# EAGLE design USB3300 (EAGLE 7.6.0)
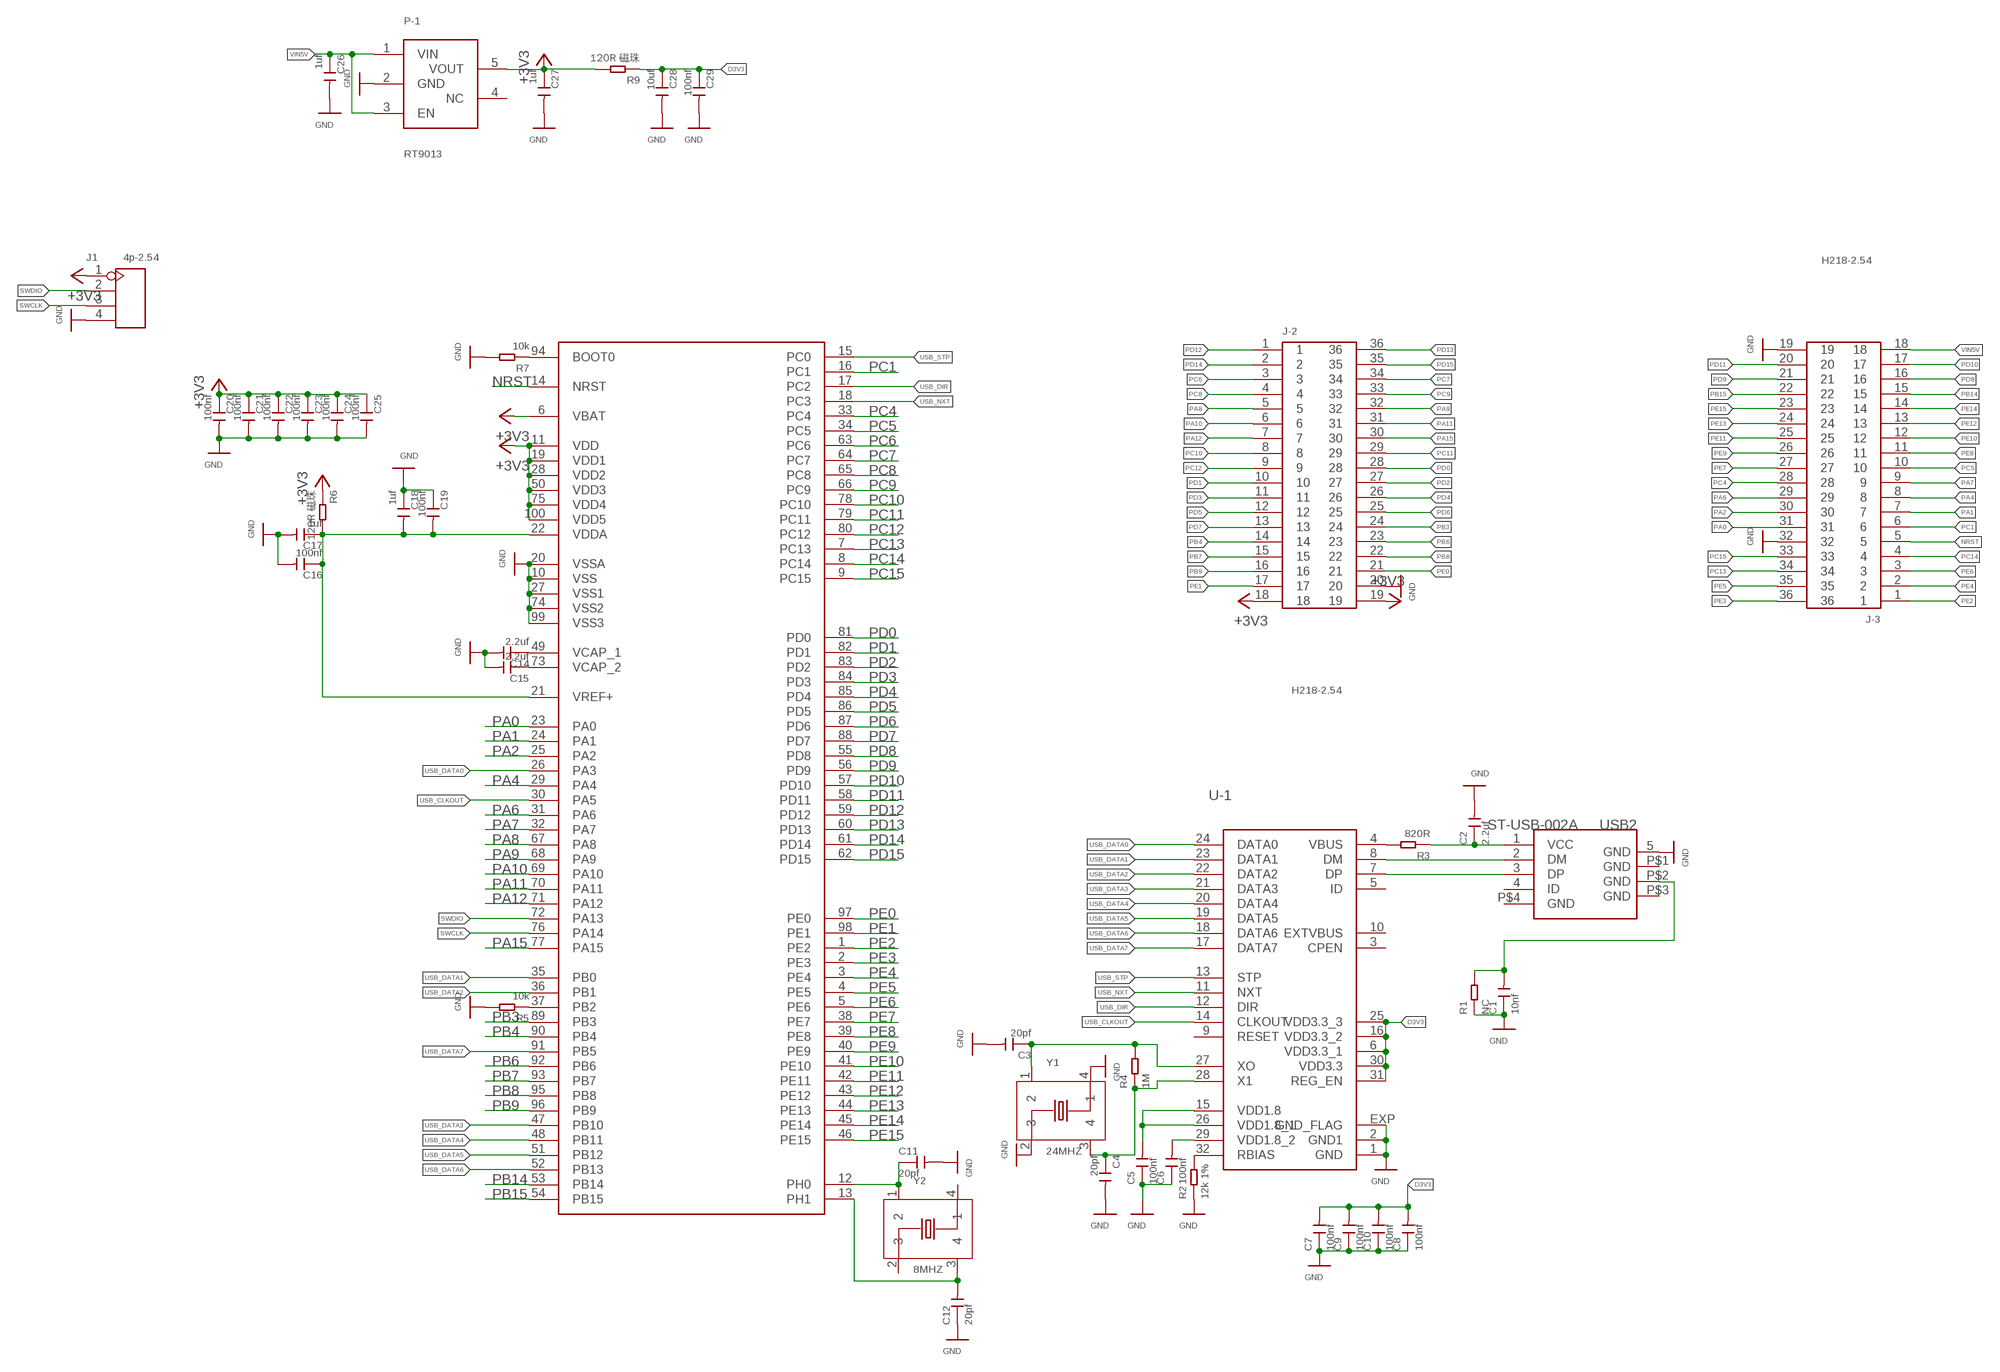
[diagram p0: schematic, sheet 1]

## Parts
C1  10nf  CERAMIC-0.5PF-50V-0.1PF-NPO(0603)  [C0603]
C2  2.2uf  CERAMIC-0.5PF-50V-0.1PF-NPO(0603)  [C0603]
C3  20pf  CERAMIC-0.5PF-50V-0.1PF-NPO(0603)  [C0603]
C4  20pf  CERAMIC-0.5PF-50V-0.1PF-NPO(0603)  [C0603]
C5  100nf  CERAMIC-0.5PF-50V-0.1PF-NPO(0603)  [C0603]
C6  100nf  CERAMIC-0.5PF-50V-0.1PF-NPO(0603)  [C0603]
C7  100nf  CERAMIC-0.5PF-50V-0.1PF-NPO(0603)  [C0603]
C8  100nf  CERAMIC-0.5PF-50V-0.1PF-NPO(0603)  [C0603]
C9  100nf  CERAMIC-0.5PF-50V-0.1PF-NPO(0603)  [C0603]
C10  100nf  CERAMIC-0.5PF-50V-0.1PF-NPO(0603)  [C0603]
C11  20pf  CERAMIC-0.5PF-50V-0.1PF-NPO(0603)  [C0603]
C12  20pf  CERAMIC-0.5PF-50V-0.1PF-NPO(0603)  [C0603]
C14  2.2uf  CERAMIC-0.5PF-50V-0.1PF-NPO(0603)  [C0603]
C15  2.2uf  CERAMIC-0.5PF-50V-0.1PF-NPO(0603)  [C0603]
C16  100nf  CERAMIC-0.5PF-50V-0.1PF-NPO(0603)  [C0603]
C17  1uf  CERAMIC-0.5PF-50V-0.1PF-NPO(0603)  [C0603]
C18  1uf  CERAMIC-0.5PF-50V-0.1PF-NPO(0603)  [C0603]
C19  100nf  CERAMIC-0.5PF-50V-0.1PF-NPO(0603)  [C0603]
C20  100nf  CERAMIC-0.5PF-50V-0.1PF-NPO(0603)  [C0603]
C21  100nf  CERAMIC-0.5PF-50V-0.1PF-NPO(0603)  [C0603]
C22  100nf  CERAMIC-0.5PF-50V-0.1PF-NPO(0603)  [C0603]
C23  100nf  CERAMIC-0.5PF-50V-0.1PF-NPO(0603)  [C0603]
C24  100nf  CERAMIC-0.5PF-50V-0.1PF-NPO(0603)  [C0603]
C25  100nf  CERAMIC-0.5PF-50V-0.1PF-NPO(0603)  [C0603]
C26  1uf  CERAMIC-0.5PF-50V-0.1PF-NPO(0603)  [C0603]
C27  1uf  CERAMIC-0.5PF-50V-0.1PF-NPO(0603)  [C0603]
C28  10uf  CERAMIC-0.5PF-50V-0.1PF-NPO(0603)  [C0603]
C29  100nf  CERAMIC-0.5PF-50V-0.1PF-NPO(0603)  [C0603]
J1  4p-2.54  DIP-BLACK-FEMALE-HEADER-VERT(4P-2.54)  [H4-2.54]
J-2  H218-2.54  [H2X18-2.54]
J-3  H218-2.54  [H2X18-2.54]
P-1  RT9013  [SOT23-5]
R1  NC  SMD-RES-0R-1%-1/10W(0603)  [R0603]
R2  12k 1%  SMD-RES-0R-1%-1/10W(0603)  [R0603]
R3  820R  SMD-RES-0R-1%-1/10W(0603)  [R0603]
R4  1M  SMD-RES-0R-1%-1/10W(0603)  [R0603]
R5  10k  SMD-RES-0R-1%-1/10W(0603)  [R0603]
R6  120R 磁珠  SMD-RES-0R-1%-1/10W(0603)  [R0603]
R7  10k  SMD-RES-0R-1%-1/10W(0603)  [R0603]
R9  120R 磁珠  SMD-RES-0R-1%-1/10W(0603)  [R0603]
U$1  STM32F40XSTM32D40X  [LQFP100]
U-1  USB3300  [QFN32]
USB2  ST-USB-002A  MINI-USB-RCPT-B-5PS-R/A-SMD(ST-USB-002A)  [MINIUSB5+4P-SMD-0.8-90D]
Y1  24MHZ  SMD-CRYSTAL-30MHZ-10PF-10PPM-60R(4P-3.2X2.5MM)  [X4-SMD-3.2X2.5X0.7MM]
Y2  8MHZ  SMD-CRYSTAL-27.12MHZ-18PF-30PPM-60R(4P-3.2X2.5MM)  [X4-SMD-3.2X2.5X0.7MM]

## Nets
+3V3: C20.1 C21.1 C22.1 C23.1 C24.1 C25.1 C27.1 J1.1 J-2.18 J-2.19 P-1.5(VOUT) R6.1 R9.2 U$1.6(VBAT) U$1.11(VDD) U$1.19(VDD1) U$1.28(VDD2) U$1.50(VDD3) U$1.75(VDD4) U$1.100(VDD5)
D3V3: C7.2 C8.2 C9.2 C10.2 C28.1 C29.1 R9.1 U-1.6(VDD3.3_1) U-1.16(VDD3.3_2) U-1.25(VDD3.3_3) U-1.30(VDD3.3) U-1.31(REG_EN)
GND: C1.1 C2.2 C3.2 C4.2 C5.1 C6.1 C7.1 C8.1 C9.1 C10.1 C11.2 C12.1 C14.2 C15.2 C16.2 C17.2 C18.1 C19.1 C20.2 C21.2 C22.2 C23.2 C24.2 C25.2 C26.2 C27.2 C28.2 C29.2 J1.4 J-2.20 J-3.19 J-3.32 P-1.2(GND) R1.1 R2.1 R5.2 R7.2 U$1.10(VSS) U$1.20(VSSA) U$1.27(VSS1) U$1.74(VSS2) U$1.99(VSS3) U-1.1(GND) U-1.2(GND1) U-1.EXP(GND_FLAG) USB2.5(GND) Y1.2 Y1.4
N$1: U-1.8(DM) USB2.2(DM)
N$2: U-1.7(DP) USB2.3(DP)
N$3: C3.1 R4.2 U-1.27(XO) Y1.1
N$4: R2.2 U-1.32(RBIAS)
N$5: R3.2 U-1.4(VBUS)
N$6: C4.1 R4.1 U-1.28(X1) Y1.3
N$7: C5.2 U-1.15(VDD1.8) U-1.26(VDD1.8_1)
N$8: C6.2 U-1.29(VDD1.8_2)
N$9: C11.1 U$1.12(PH0) Y2.1
N$10: C12.2 U$1.13(PH1) Y2.3
N$11: R7.1 U$1.94(BOOT0)
N$12: C16.1 C17.1 C18.2 C19.2 R6.2 U$1.21(VREF+) U$1.22(VDDA)
N$13: C14.1 U$1.49(VCAP_1)
N$14: C15.1 U$1.73(VCAP_2)
N$15: C2.1 R3.1 USB2.1(VCC)
N$16: R5.1 U$1.37(PB2)
N$18: C1.2 R1.2 USB2.P$2(GND)
NRST: J-3.5 U$1.14(NRST)
PA0: J-3.31 U$1.23(PA0)
PA1: J-3.7 U$1.24(PA1)
PA2: J-3.30 U$1.25(PA2)
PA4: J-3.8 U$1.29(PA4)
PA6: J-3.29 U$1.31(PA6)
PA7: J-3.9 U$1.32(PA7)
PA8: J-2.5 U$1.67(PA8)
PA9: J-2.32 U$1.68(PA9)
PA10: J-2.6 U$1.69(PA10)
PA11: J-2.31 U$1.70(PA11)
PA12: J-2.7 U$1.71(PA12)
PA15: J-2.30 U$1.77(PA15)
PB3: J-2.24 U$1.89(PB3)
PB4: J-2.14 U$1.90(PB4)
PB6: J-2.23 U$1.92(PB6)
PB7: J-2.15 U$1.93(PB7)
PB8: J-2.22 U$1.95(PB8)
PB9: J-2.16 U$1.96(PB9)
PB14: J-3.15 U$1.53(PB14)
PB15: J-3.22 U$1.54(PB15)
PC1: J-3.6 U$1.16(PC1)
PC4: J-3.28 U$1.33(PC4)
PC5: J-3.10 U$1.34(PC5)
PC6: J-2.3 U$1.63(PC6)
PC7: J-2.34 U$1.64(PC7)
PC8: J-2.4 U$1.65(PC8)
PC9: J-2.33 U$1.66(PC9)
PC10: J-2.8 U$1.78(PC10)
PC11: J-2.29 U$1.79(PC11)
PC12: J-2.9 U$1.80(PC12)
PC13: J-3.34 U$1.7(PC13)
PC14: J-3.4 U$1.8(PC14)
PC15: J-3.33 U$1.9(PC15)
PD0: J-2.28 U$1.81(PD0)
PD1: J-2.10 U$1.82(PD1)
PD2: J-2.27 U$1.83(PD2)
PD3: J-2.11 U$1.84(PD3)
PD4: J-2.26 U$1.85(PD4)
PD5: J-2.12 U$1.86(PD5)
PD6: J-2.25 U$1.87(PD6)
PD7: J-2.13 U$1.88(PD7)
PD8: J-3.16 U$1.55(PD8)
PD9: J-3.21 U$1.56(PD9)
PD10: J-3.17 U$1.57(PD10)
PD11: J-3.20 U$1.58(PD11)
PD12: J-2.1 U$1.59(PD12)
PD13: J-2.36 U$1.60(PD13)
PD14: J-2.2 U$1.61(PD14)
PD15: J-2.35 U$1.62(PD15)
PE0: J-2.21 U$1.97(PE0)
PE1: J-2.17 U$1.98(PE1)
PE2: J-3.1 U$1.1(PE2)
PE3: J-3.36 U$1.2(PE3)
PE4: J-3.2 U$1.3(PE4)
PE5: J-3.35 U$1.4(PE5)
PE6: J-3.3 U$1.5(PE6)
PE7: J-3.27 U$1.38(PE7)
PE8: J-3.11 U$1.39(PE8)
PE9: J-3.26 U$1.40(PE9)
PE10: J-3.12 U$1.41(PE10)
PE11: J-3.25 U$1.42(PE11)
PE12: J-3.13 U$1.43(PE12)
PE13: J-3.24 U$1.44(PE13)
PE14: J-3.14 U$1.45(PE14)
PE15: J-3.23 U$1.46(PE15)
SWCLK: J1.3 U$1.76(PA14)
SWDIO: J1.2 U$1.72(PA13)
USB_CLKOUT: U$1.30(PA5) U-1.14(CLKOUT)
USB_DATA0: U$1.26(PA3) U-1.24(DATA0)
USB_DATA1: U$1.35(PB0) U-1.23(DATA1)
USB_DATA2: U$1.36(PB1) U-1.22(DATA2)
USB_DATA3: U$1.47(PB10) U-1.21(DATA3)
USB_DATA4: U$1.48(PB11) U-1.20(DATA4)
USB_DATA5: U$1.51(PB12) U-1.19(DATA5)
USB_DATA6: U$1.52(PB13) U-1.18(DATA6)
USB_DATA7: U$1.91(PB5) U-1.17(DATA7)
USB_DIR: U$1.17(PC2) U-1.12(DIR)
USB_NXT: U$1.18(PC3) U-1.11(NXT)
USB_STP: U$1.15(PC0) U-1.13(STP)
VIN5V: C26.1 J-3.18 P-1.1(VIN) P-1.3(EN)
Unconnected: P-1.4(NC) U-1.3(CPEN) U-1.5(ID) U-1.9(RESET) U-1.10(EXTVBUS) USB2.4(ID) USB2.P$1(GND) USB2.P$3(GND) USB2.P$4(GND) Y2.2 Y2.4

## Library data of the parts
C1-C12 C14-C29 = Seeed-OPL-Capacitor:CERAMIC-0.5PF-50V-0.1PF-NPO(0603): 302010115; VALUE: 0.5PF 50V
J1 = Seeed-OPL-Connector:DIP-BLACK-FEMALE-HEADER-VERT(4P-2.54): 320030017; MPN: F185-1104A1BSYA1
J-2 J-3 = 64ch EEG:H2*18-2.54
P-1 = 1-LDA_Board:RT9013
R1-R7 R9 = Seeed-OPL-Resistor:SMD-RES-0R-1%-1/10W(0603): 301010203; MPN: AC0603FR-070RL; VALUE: 0R 1/10W
U$1 = 1-intan:STM32F40X: Features • Core: ARM 32-bit Cortex™-M4 CPU with FPU, Adaptive real-time accelerator (ART Accelerator™) allowing 0-wait state execution from Flash memory, frequency up to 168 MHz, memory protection unit, 210 DMIPS/ 1.25 DMIPS/MHz (Dhrystone 2.1), and DSP instructions • Memories – Up to 1 Mbyte of Flash memory – Up to 192+4 Kbytes of SRAM including 64- Kbyte of CCM (core coupled memory) data RAM – Flexible static memory controller supporting Compact Flash, SRAM, PSRAM, NOR and NAND memories • LCD parallel interface, 8080/6800 modes • Clock, reset and supply management – 1.8 V to 3.6 V application supply and I/Os – POR, PDR, PVD and BOR – 4-to-26 MHz crystal oscillator – Internal 16 MHz factory-trimmed RC (1% accuracy) – 32 kHz oscillator for RTC with calibration – Internal 32 kHz RC with calibration • Low power – Sleep, Stop and Standby modes – VBAT supply for RTC, 20×32 bit backup registers + optional 4 KB backup SRAM • 3×12-bit, 2.4 MSPS A/D converters: up to 24 channels and 7.2 MSPS in triple interleaved mode • 2×12-bit D/A converters • General-purpose DMA: 16-stream DMA controller with FIFOs and burst support • Up to 17 timers: up to twelve 16-bit and two 32- bit timers up to 168 MHz, each with up to 4 IC/OC/PWM or pulse counter and quadrature (incremental) encoder input • Debug mode – Serial wire debug (SWD) & JTAG interfaces – Cortex-M4 Embedded Trace Macrocell™ • Up to 140 I/O ports with interrupt capability – Up to 136 fast I/Os up to 84 MHz – Up to 138 5 V-tolerant I/Os • Up to 15 communication interfaces – Up to 3 × I2C interfaces (SMBus/PMBus) – Up to 4 USARTs/2 UARTs (10.5 Mbit/s, ISO 7816 interface, LIN, IrDA, modem control) – Up to 3 SPIs (42 Mbits/s), 2 with muxed full-duplex I2S to achieve audio class accuracy via internal audio PLL or external clock – 2 × CAN interfaces (2.0B Active) – SDIO interface • Advanced connectivity – USB 2.0 full-speed device/host/OTG controller with on-chip PHY – USB 2.0 high-speed/full-speed device/host/OTG controller with dedicated DMA, on-chip full-speed PHY and ULPI – 10/100 Ethernet MAC with dedicated DMA: supports IEEE 1588v2 hardware, MII/RMII • 8- to 14-bit parallel camera interface up to 54 Mbytes/s • True random number generator • CRC calculation unit • 96-bit unique ID • RTC: subsecond accuracy, hardware calendar
U-1 = 64ch EEG:USB3300
USB2 = Seeed-OPL-Connector:MINI-USB-RCPT-B-5PS-R/A-SMD(ST-USB-002A): 320010013; MPN: ST-USB-002A
Y1 = Seeed-OPL-Crystal-Oscillator:SMD-CRYSTAL-30MHZ-10PF-10PPM-60R(4P-3.2X2.5MM): 306010035; MPN: 7M30000024; VALUE: 30MHZ
Y2 = 1-LDA_Board:SMD-CRYSTAL-27.12MHZ-18PF-30PPM-60R(4P-3.2X2.5MM): 306010027; MPN: 7M-27.120MAAJ-T; VALUE: 27.12MHZ

## Board
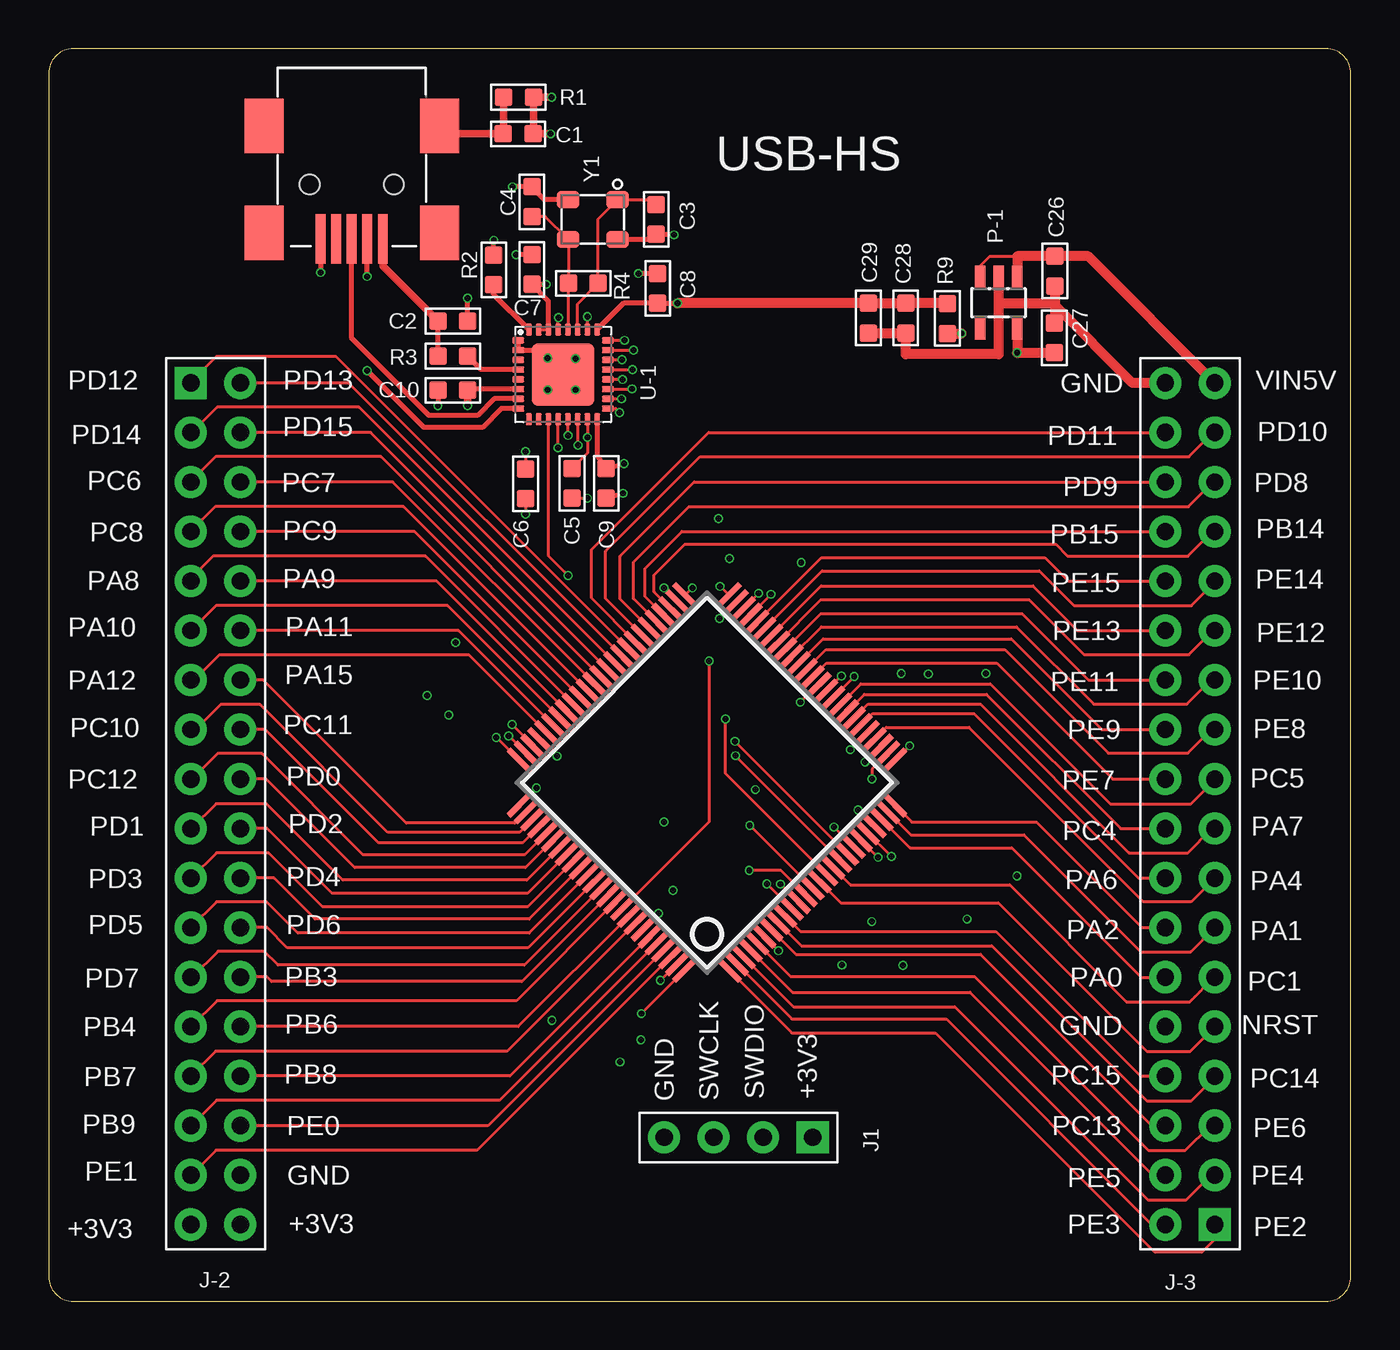
[diagram p1: board, top side]
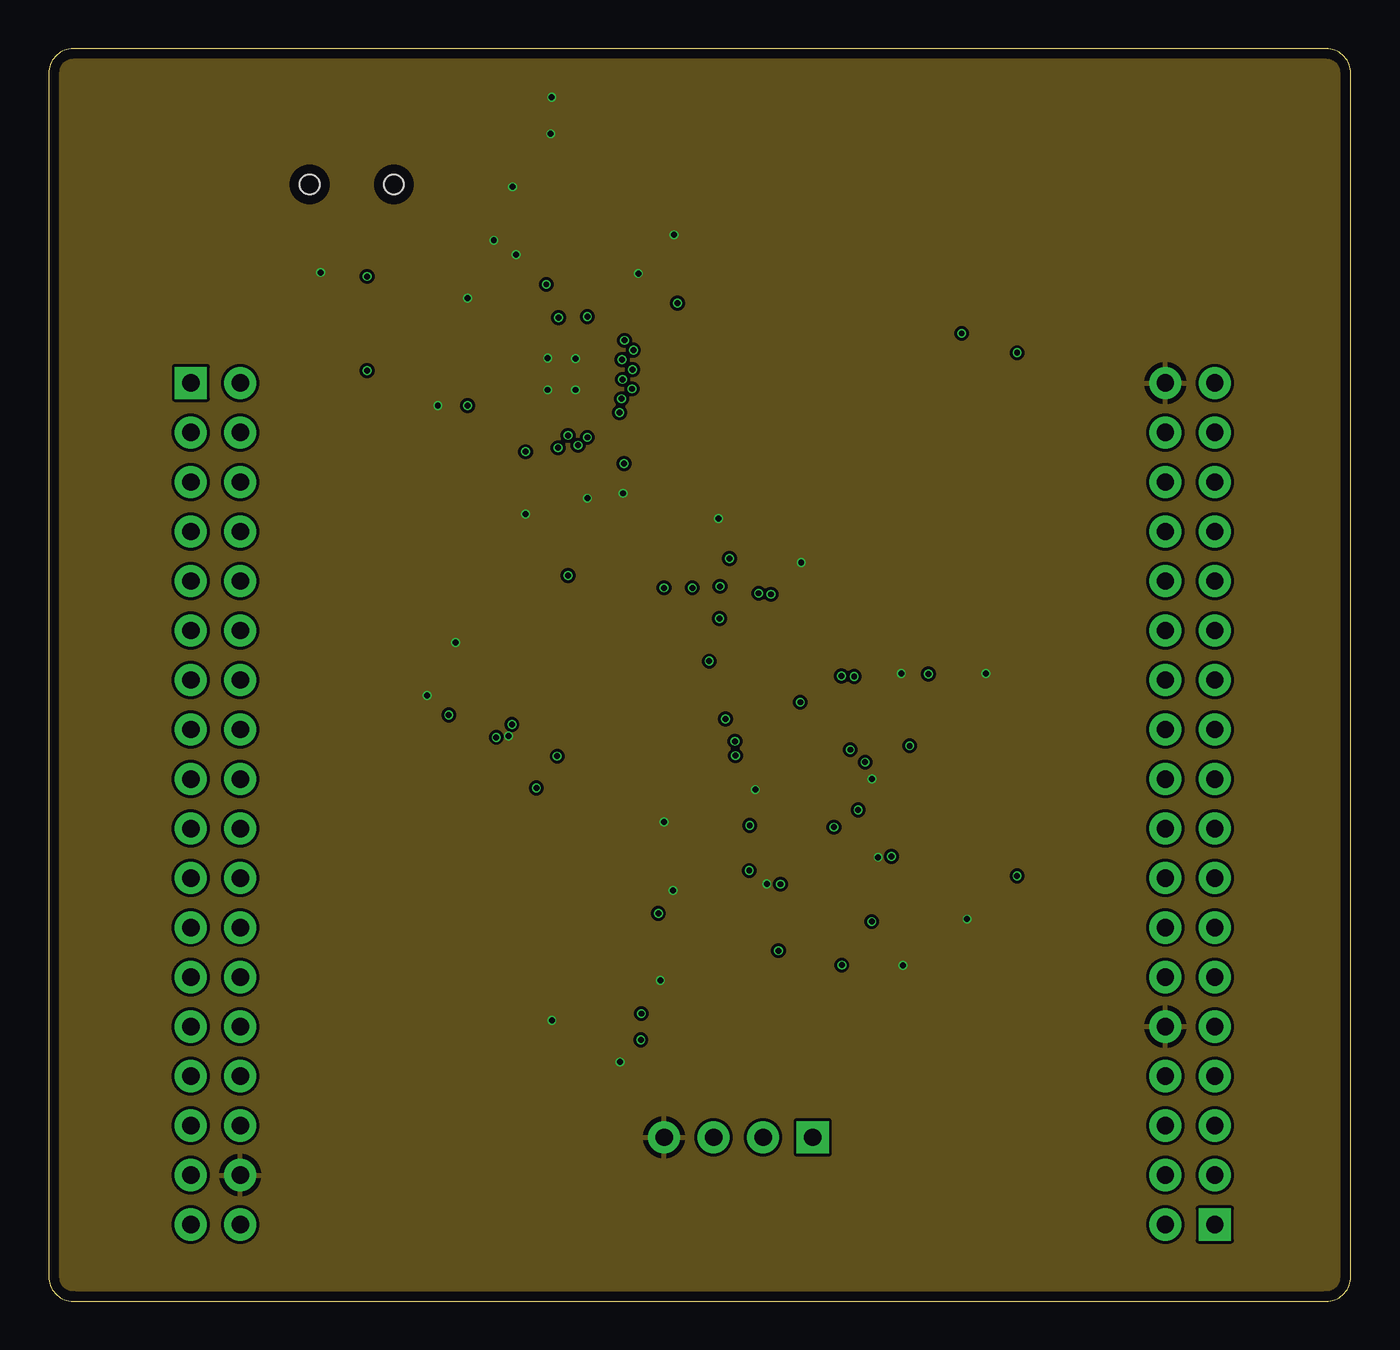
[diagram p2: board, inner layer Gnd]
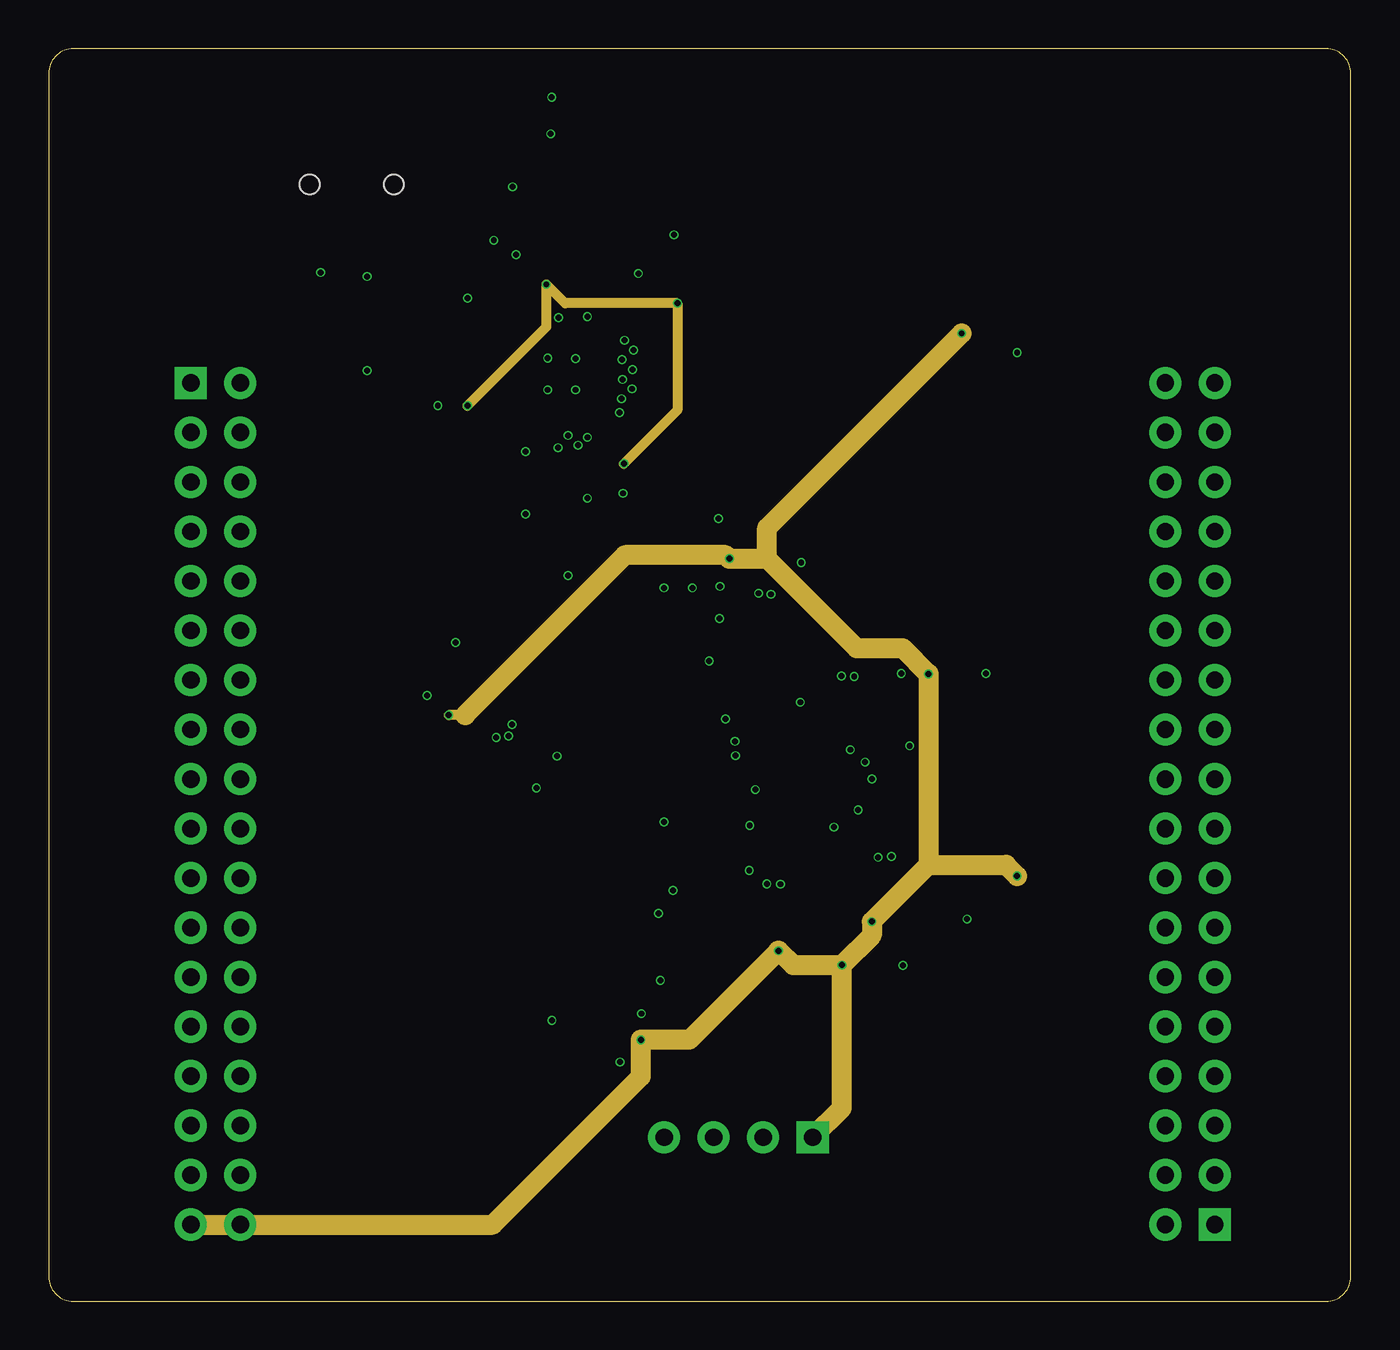
[diagram p3: board, inner layer Vcc]
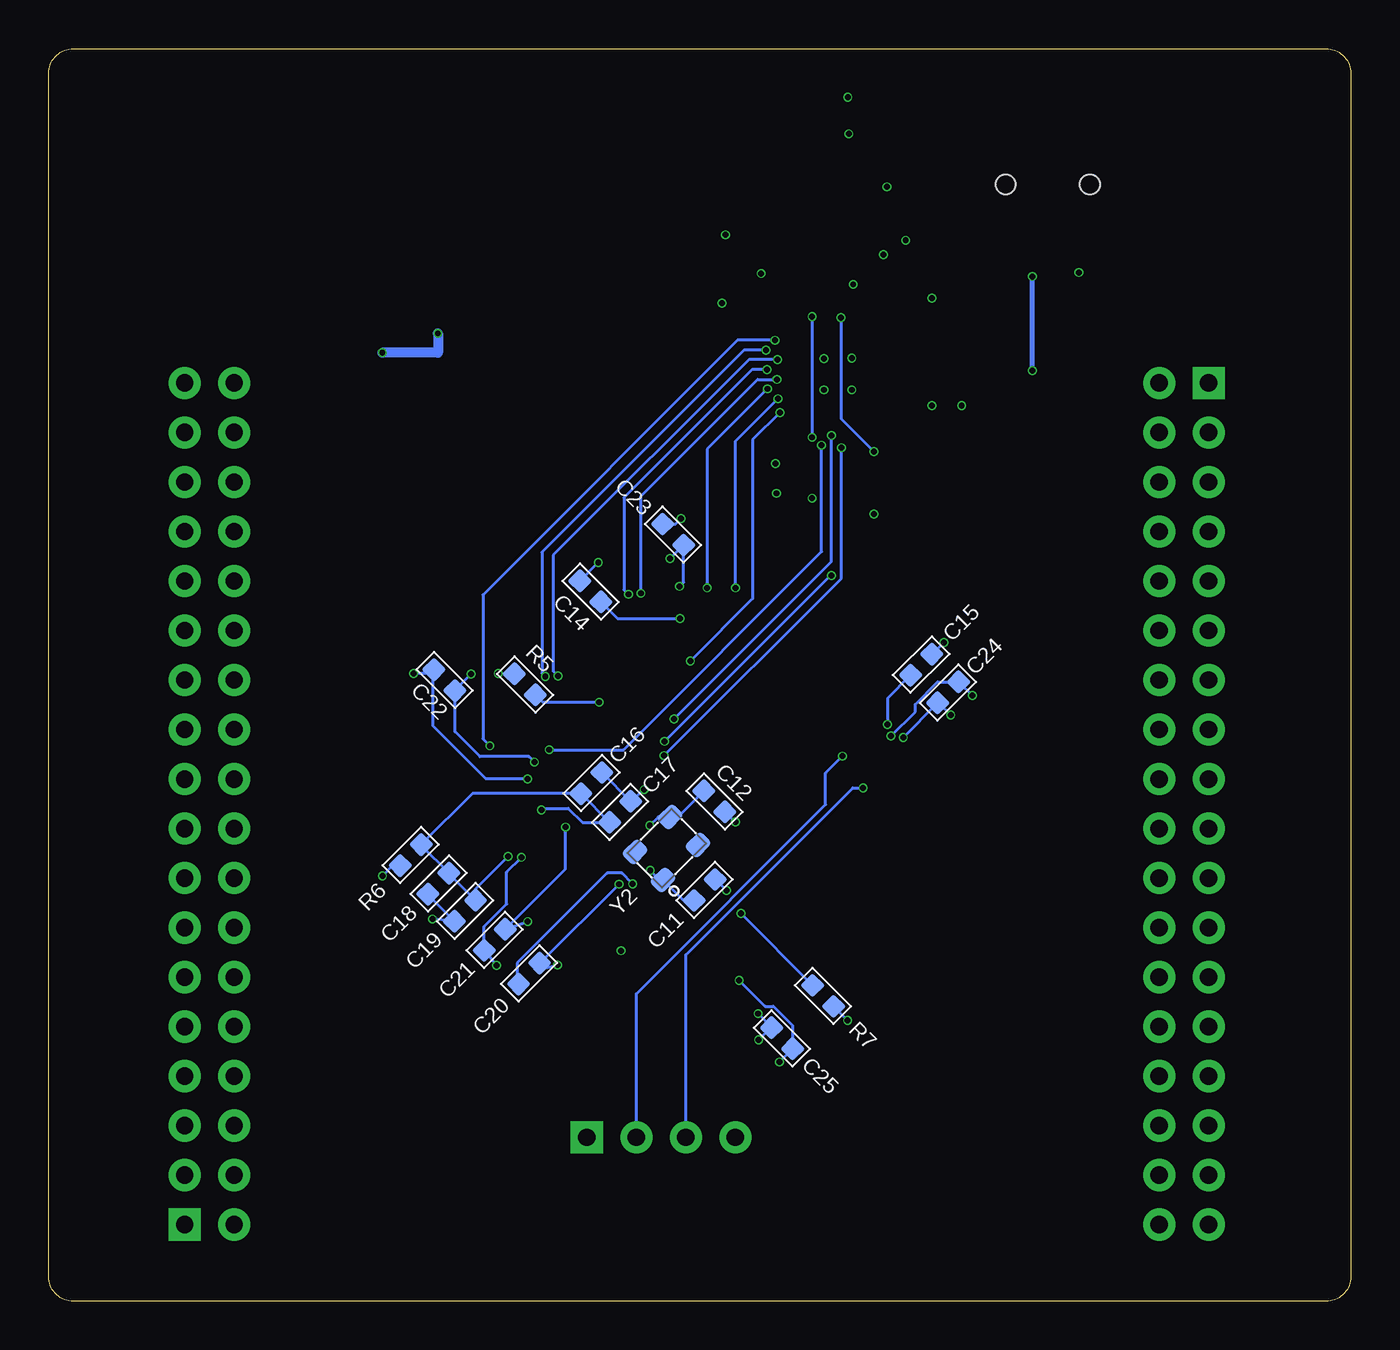
[diagram p4: board, bottom side, seen from below]

Size 66.8 x 64.26 mm. Coordinates in mm from the lower left corner, seen from the top.
Outline: 0,62.99 0,1.27 arc90 1.27,0 65.53,0 arc90 66.8,1.27 66.8,62.99 arc90 65.53,64.26 1.27,64.26 arc90 0,62.99
Copper layers (1*2+3*16): Top 0.035mm / dielectric 1.5mm / Gnd 0.035mm / dielectric 0.15mm / Vcc 0.035mm / dielectric 0.2mm / Bottom 0.035mm
Design rules "default *": minimum track width 6mil, minimum drill 12mil, track to track 6mil, track to pad 6mil, pad to pad 6mil, via to via 6mil, smd to smd 6mil, copper to edge 20mil, drill to drill 8mil, minimum pad ring 2mil, minimum via ring 2mil, stop-mask expansion 2mil, vias tented up to drill 12mil, thermal gap 10mil

### Footprints (pad centres in the part's own frame; a part is rotated, then mirrored left to right if it is on the bottom)
C0603 = smd 0.889 x 0.889: 1 0,0.762; 2 0,-0.762
H4-2.54 = drill 0.889 pad 1.651 square: 1 0,3.81 | drill 0.889 pad 1.651: 2 0,1.27; 3 0,-1.27; 4 0,-3.81
H2X18-2.54 = drill 0.889 pad 1.651 square: 1 -1.27,21.59 | drill 0.889 pad 1.651: 2 -1.27,19.05; 3 -1.27,16.51; 4 -1.27,13.97; 5 -1.27,11.43; 6 -1.27,8.89; 7 -1.27,6.35; 8 -1.27,3.81; 9 -1.27,1.27; 10 -1.27,-1.27; 11 -1.27,-3.81; 12 -1.27,-6.35; 13 -1.27,-8.89; 14 -1.27,-11.43; 15 -1.27,-13.97; 16 -1.27,-16.51; 17 -1.27,-19.05; 18 -1.27,-21.59; 19 1.27,-21.59; 20 1.27,-19.05; 21 1.27,-16.51; 22 1.27,-13.97; 23 1.27,-11.43; 24 1.27,-8.89; 25 1.27,-6.35; 26 1.27,-3.81; 27 1.27,-1.27; 28 1.27,1.27; 29 1.27,3.81; 30 1.27,6.35; 31 1.27,8.89; 32 1.27,11.43; 33 1.27,13.97; 34 1.27,16.51; 35 1.27,19.05; 36 1.27,21.59
SOT23-5 = smd 0.55 x 1.2: 1 -0.95,-1.3; 2 0,-1.3; 3 0.95,-1.3; 4 0.95,1.3; 5 -0.95,1.3
R0603 = smd 0.889 x 0.889: 1 0,0.762; 2 0,-0.762
LQFP100 = smd 1.6 x 0.3: 1 -7.6,6; 2 -7.6,5.5; 3 -7.6,5; 4 -7.6,4.5; 5 -7.6,4; 6 -7.6,3.5; 7 -7.6,3; 8 -7.6,2.5; 9 -7.6,2; 10 -7.6,1.5; 11 -7.6,1; 12 -7.6,0.5; 13 -7.6,0; 14 -7.6,-0.5; 15 -7.6,-1; 16 -7.6,-1.5; 17 -7.6,-2; 18 -7.6,-2.5; 19 -7.6,-3; 20 -7.6,-3.5; 21 -7.6,-4; 22 -7.6,-4.5; 23 -7.6,-5; 24 -7.6,-5.5; 25 -7.6,-6; 51 7.6,-6; 52 7.6,-5.5; 53 7.6,-5; 54 7.6,-4.5; 55 7.6,-4; 56 7.6,-3.5; 57 7.6,-3; 58 7.6,-2.5; 59 7.6,-2; 60 7.6,-1.5; 61 7.6,-1; 62 7.6,-0.5; 63 7.6,0; 64 7.6,0.5; 65 7.6,1; 66 7.6,1.5; 67 7.6,2; 68 7.6,2.5; 69 7.6,3; 70 7.6,3.5; 71 7.6,4; 72 7.6,4.5; 73 7.6,5; 74 7.6,5.5; 75 7.6,6 | smd 0.3 x 1.6: 26 -6,-7.6; 27 -5.5,-7.6; 28 -5,-7.6; 29 -4.5,-7.6; 30 -4,-7.6; 31 -3.5,-7.6; 32 -3,-7.6; 33 -2.5,-7.6; 34 -2,-7.6; 35 -1.5,-7.6; 36 -1,-7.6; 37 -0.5,-7.6; 38 0,-7.6; 39 0.5,-7.6; 40 1,-7.6; 41 1.5,-7.6; 42 2,-7.6; 43 2.5,-7.6; 44 3,-7.6; 45 3.5,-7.6; 46 4,-7.6; 47 4.5,-7.6; 48 5,-7.6; 49 5.5,-7.6; 50 6,-7.6; 76 6,7.6; 77 5.5,7.6; 78 5,7.6; 79 4.5,7.6; 80 4,7.6; 81 3.5,7.6; 82 3,7.6; 83 2.5,7.6; 84 2,7.6; 85 1.5,7.6; 86 1,7.6; 87 0.5,7.6; 88 0,7.6; 89 -0.5,7.6; 90 -1,7.6; 91 -1.5,7.6; 92 -2,7.6; 93 -2.5,7.6; 94 -3,7.6; 95 -3.5,7.6; 96 -4,7.6; 97 -4.5,7.6; 98 -5,7.6; 99 -5.5,7.6; 100 -6,7.6
QFN32 = smd 0.6 x 0.3: 1 -2.3,1.75; 2 -2.3,1.25; 3 -2.3,0.75; 4 -2.3,0.25; 5 -2.3,-0.25; 6 -2.3,-0.75; 7 -2.3,-1.25; 8 -2.3,-1.75; 17 2.3,-1.75; 18 2.3,-1.25; 19 2.3,-0.75; 20 2.3,-0.25; 21 2.3,0.25; 22 2.3,0.75; 23 2.3,1.25; 24 2.3,1.75 | smd 0.3 x 0.6: 9 -1.75,-2.3; 10 -1.25,-2.3; 11 -0.75,-2.3; 12 -0.25,-2.3; 13 0.25,-2.3; 14 0.75,-2.3; 15 1.25,-2.3; 16 1.75,-2.3; 25 1.75,2.3; 26 1.25,2.3; 27 0.75,2.3; 28 0.25,2.3; 29 -0.25,2.3; 30 -0.75,2.3; 31 -1.25,2.3; 32 -1.75,2.3 | smd 3.2 x 3.2: EXP 0,0
MINIUSB5+4P-SMD-0.8-90D = smd 2.54 x 0.508: 1 0.381,-1.6; 2 0.381,-0.8; 3 0.381,0; 4 0.381,0.8; 5 0.381,1.6 | smd 2.794 x 2: P$1 6.175,4.5; P$2 6.175,-4.5; P$3 0.675,4.5; P$4 0.675,-4.5 | hole 1.016: 3.175,-2.159; 3.175,2.159
X4-SMD-3.2X2.5X0.7MM = smd 1.143 x 0.889: 1 -1.27,-1.016; 2 1.27,-1.016; 3 1.27,1.016; 4 -1.27,1.016

### Placement (x,y rotation side)
C1  24.08,59.89 270 top
C2  20.73,50.29 90 top
C3  31.17,55.5 0 top
C4  24.79,56.41 180 top
C5  26.85,41.96 180 top
C6  24.46,41.94 180 top
C7  24.79,52.93 0 top
C8  31.24,51.97 0 top
C9  28.6,41.96 180 top
C10  20.73,46.74 90 top
C11  33.15,21.1 135 bottom
C12  32.65,25.65 225 bottom
C14  39.01,36.42 225 bottom
C15  22.04,32.66 135 bottom
C16  38.96,26.59 135 bottom
C17  37.49,25.12 135 bottom
C18  46.81,21.43 135 bottom
C19  45.44,20.03 135 bottom
C20  42.16,16.82 315 bottom
C21  43.92,18.54 315 bottom
C22  46.5,31.87 225 bottom
C23  34.77,39.34 225 bottom
C24  20.66,31.24 135 bottom
C25  29.17,13.5 45 bottom
C26  51.62,52.85 0 top
C27  51.6,49.43 180 top
C28  43.97,50.44 0 top
C29  42.06,50.44 0 top
J1  35.38,8.41 270 top
J-2  8.56,25.52 0 top
J-3  58.56,25.52 180 top
P-1  48.73,51.23 180 top
R1  24.1,61.77 270 top
R2  22.83,52.91 0 top
R3  20.73,48.49 90 top
R4  27.43,52.22 90 top
R5  42.38,31.65 225 bottom
R6  48.23,22.89 135 bottom
R7  27.07,15.67 45 bottom
R9  46.1,50.42 0 top
U$1  33.77,26.61 135 top
U-1  26.39,47.55 0 top
USB2  15.54,54.13 90 top
Y1  27.91,55.5 180 top
Y2  35.1,23.24 45 bottom

### Tracks (layer width: path | path; a pad name or v marks a point on that pad's centre or on a via)
+3V3  (via drill 0.3 pad 0.45)
  Top 0.152: U$1.11 37.57,21.4 v37.54,21.4 | v40.29,24.32 41.26,23.36 U$1.19 | U$1.28 41.9,27.66 v41.88,27.66 | U$1.50 34.45,36.68 v34.44,36.68 | U$1.75 v22.97,28.93 v22.96,28.93 | U$1.100 v30.41,14.76 v30.4,14.76 | U$1.6 37.44,17.99 v37.44,17.98
  Top 0.508: P-1.5 v49.69,48.66 C27.1 | R9.2 v46.84,49.66
  Vcc 0.508: v34.92,38.1 34.75,38.28 | 21.36,30.07 v20.52,30.07
  Vcc 1.016: v40.69,17.25 42.23,18.78 v42.23,19.48 45.14,22.39 | v40.69,17.25 38.2,17.25 37.47,17.98 v37.44,17.98 32.87,13.41 v30.38,13.41 30.38,11.53 22.78,3.93 J-2.19 J-2.18 | J1.1 40.69,9.91 v40.69,17.25 | 34.75,38.28 29.57,38.28 21.36,30.07 | v34.92,38.1 36.85,38.1 | 36.85,38.1 41.45,33.5 43.82,33.5 v45.14,32.18 45.14,22.39 | 45.14,22.39 49.11,22.39 v49.68,21.82 | 36.85,38.1 36.85,39.67 v46.84,49.66
  Bottom 0.152: v37.54,21.4 41.58,17.36 | 41.58,17.36 C20.1 | v42.23,19.48 C21.1 40.29,22.17 v40.29,24.32 | v41.88,27.66 42.16,27.94 44.68,27.94 45.97,29.23 C22.1 45.97,31.36 v45.14,32.18 | 41.58,17.36 41.32,17.09 v40.69,17.25 | C24.1 21.18,30.68 | R6.1 49.15,22.35 v49.68,21.82 | v34.92,38.1 C23.1 34.23,36.89 v34.44,36.68 | C24.1 21.15,30.7 v20.52,30.07 | v22.96,28.93 C24.1 | v30.38,13.41 29.76,14.03 C25.1 29.71,14.06 v30.4,14.76
  Bottom 0.508: v46.84,49.66 46.84,48.66 v49.69,48.66
D3V3  (via drill 0.3 pad 0.45)
  Top 0.152: U-1.31 U-1.30
  Top 0.254: v29.52,42.98 C9.2 28.14,43.39 U-1.16 | v25.53,52.17 C7.2 25.64,51.32 U-1.30 | v32.26,51.21 C8.2 29.5,51.21 U-1.25 | U-1.6 21.55,46.8 C10.2
  Top 0.381: C10.2 v21.49,45.95
  Top 0.508: R9.1 46.1,51.21 C28.1 C29.1 v32.26,51.21
  Vcc 0.508: v21.49,45.95 25.53,49.99 v25.53,52.17 26.49,51.21 v32.26,51.21 32.26,45.72 v29.52,42.98
GND  (via drill 0.3 pad 0.45)
  Top 0.152: U$1.99 31.4,16.46 v31.38,16.46 | U$1.74 23.61,29 v23.59,29 | U$1.10 v36.85,21.42 v36.84,21.42 | v42.55,22.78 | v42.55,22.78 U$1.20 | C5.1 v27.64,41.2 | C6.1 v24.46,40.39 | 25.76,46.81 25.76,46.91 U-1.EXP | U$1.27 42.24,27.3 v42.24,26.8
  Top 0.254: R2.1 v22.84,54.43 | C2.2 v21.49,51.46 | C7.1 v23.98,53.7 | v23.8,57.17 C4.2 25.45,56.52 Y1.2 | v32.08,54.71 32.05,54.74 C3.2 30.91,54.48 Y1.4 | C8.1 v30.25,52.73 | C10.1 v19.96,45.95 | USB2.5 v13.95,52.78 | v13.95,52.78 | U-1.1 U-1.2 25.29,48.8 v25.6,48.39 25.76,46.81 v25.6,46.76 v27.03,46.76 v27.03,48.36 | C9.1 v29.46,41.45
  Top 0.381: v25.76,59.89 C1.1 24.87,59.92 R1.1 v25.81,61.77
  Top 0.508: P-1.2 48.73,51.21 | 48.73,51.21 51.61,51.21 | 51.61,51.21 51.61,51.1 | 51.61,51.1 51.61,50.19 C27.2 | C26.2 51.62,51.21 51.61,51.21 | J-3.19 55.61,47.11 51.61,51.1 | C29.2 C28.2 43.97,48.59 48.73,48.59 48.73,51.21
  Bottom 0.152: v29.32,12.27 C25.2 28.63,14.14 29.62,15.13 30.05,15.13 v31.38,16.46 | R7.2 v25.81,14.41 | v19.42,31.08 C24.2 21.2,31.78 22.35,30.63 22.35,30.23 v23.59,29 | C15.2 21.47,33.2 v20.87,33.79 | v36.84,21.42 37.4,21.97 38.15,21.97 42.77,17.36 42.77,16.35 C20.2 | v43.83,17.23 44.42,18 C21.2 44.46,19.23 43.31,20.37 43.31,22.03 v42.55,22.78 | v47.12,19.61 C19.1 47.35,20.86 C18.1 | v36.25,26.25 C17.2 C16.2 | C12.1 31.59,24.59 v31.57,24.59 | C22.2 47.24,32.21 v48.08,32.21 | 47.09,32.36 C22.2 | R5.2 43.16,32.19 v43.74,32.21 | C14.2 v38.61,37.9 | C23.2 34.65,39.87 v34.37,40.16 | C11.2 v32.03,21.08 | v42.24,26.8 44.37,26.8 47.09,29.52 47.09,32.36 | 47.09,32.36 C22.2
  pour Gnd: -12.55,80.04 97.99,80.04 97.99,-12.01 -12.55,-12.01
N$1  (via drill 0.3 pad 0.45)
  Top 0.254: U-1.8 23.22,45.8 22.25,44.83 19.25,44.83 v16.33,47.75 | v16.33,52.58 16.33,54.5 USB2.2
  Bottom 0.254: v16.33,47.75 v16.33,52.58
N$2
  Top 0.254: U-1.7 22.86,46.3 22,45.44 19.51,45.44 15.54,49.4 USB2.3
N$3
  Top 0.152: U-1.27 27.14,51.17 R4.2 28.19,55.52 Y1.1 30.91,56.52 C3.1
N$4
  Top 0.254: U-1.32 22.84,51.66 R2.2
N$5
  Top 0.254: U-1.4 22.18,47.8 R3.2
N$6
  Top 0.152: U-1.28 26.67,49.88 R4.1 26.67,54.46 Y1.3 25.48,55.65 C4.1
N$7  (via drill 0.3 pad 0.45)
  Top 0.152: U-1.26 v27.64,50.52 | C5.2 27.64,43.51 v27.64,44.32 v27.64,44.33 U-1.15
  Bottom 0.152: v27.64,50.52 v27.64,44.32
N$8  (via drill 0.3 pad 0.45)
  Top 0.152: v24.46,43.59 C6.2 | U-1.29 26.14,50.45 v26.16,50.47
  Bottom 0.152: v24.46,43.59 26.14,45.26 26.14,50.44 v26.16,50.47
N$9  (via drill 0.3 pad 0.45)
  Top 0.152: U$1.12 37.58,22.1 v35.94,22.1
  Bottom 0.152: v35.94,22.1 35.46,21.62 Y2.1 34.23,20.56 C11.1
N$10  (via drill 0.3 pad 0.45)
  Top 0.152: U$1.13 v35.97,24.41
  Bottom 0.152: v35.97,24.41 35.52,24.85 Y2.3 34.52,24.85 C12.2
N$11  (via drill 0.3 pad 0.45)
  Top 0.152: U$1.94 v31.28,19.9
  Bottom 0.152: v31.28,19.9 R7.1
N$12  (via drill 0.3 pad 0.45)
  Top 0.152: v43.23,22.82 v43.22,22.82 U$1.21 | U$1.22 v41.54,25.21 v41.53,25.21
  Bottom 0.152: v43.23,22.82 44.91,21.15 C19.2 46.27,21.94 C18.2 47.69,23.39 R6.2 45.07,26.05 C16.1 C17.1 39.43,24.58 40.15,25.3 41.44,25.3 v41.53,25.21
N$13  (via drill 0.3 pad 0.45)
  Top 0.152: v34.42,35.03 U$1.49
  Bottom 0.152: C14.1 37.61,35.03 v34.42,35.03
N$14  (via drill 0.3 pad 0.45)
  Top 0.152: U$1.73 24.86,28.5 v23.77,29.59
  Bottom 0.152: C15.1 23.77,30.93 v23.77,29.59
N$15
  Top 0.254: R3.1 C2.1
  Top 0.381: USB2.1 17.14,53.11 C2.1
N$16  (via drill 0.3 pad 0.45)
  Top 0.152: v38.56,30.73 39.45,31.63 U$1.37
  Bottom 0.152: R5.1 41.46,30.73 v38.56,30.73
N$18
  Top 0.381: R1.2 23.34,59.92 C1.2 20.45,59.89 USB2.P$2
NRST
  Top 0.152: U$1.14 40.64,20.45 48.72,20.45 56.34,12.83 58.57,12.83 J-3.5
PA0
  Top 0.152: U$1.23 44.19,23.27 49.4,23.27 56.06,16.61 57.27,16.61 J-3.31
PA1
  Top 0.152: U$1.24 44.23,23.93 50.04,23.93 56.03,17.93 58.59,17.93 J-3.7
PA2
  Top 0.152: U$1.25 44.28,24.59 50.67,24.59 56.08,19.18 J-3.30
PA4
  Top 0.152: J-3.8 58.61,20.5 56.16,20.5 47.22,29.44 42.97,29.44 U$1.29
PA6
  Top 0.152: U$1.31 42.26,30.15 47.47,30.15 55.91,21.71 J-3.29
PA7
  Top 0.152: U$1.32 42.04,30.63 47.8,30.63 55.42,23.01 58.45,23.01 59.69,24.25 J-3.9
PA8
  Top 0.152: U$1.67 19.33,38.23 8.43,38.23 7.29,37.08 J-2.5
PA9
  Top 0.152: U$1.68 19.89,36.95 J-2.32
PA10
  Top 0.152: U$1.69 20.45,35.69 8.59,35.69 7.31,34.41 J-2.6
PA11
  Top 0.152: U$1.70 21.02,34.41 J-2.31
PA12
  Top 0.152: U$1.71 21.58,33.15 8.74,33.15 7.46,31.87 J-2.7
PA15
  Top 0.152: U$1.77 23.92,24.54 18.34,24.54 11,31.88 J-2.30
PB3
  Top 0.152: U$1.89 24.28,16.41 11.43,16.41 11.21,16.63 J-2.24
PB4
  Top 0.152: U$1.90 24,15.42 8.64,15.42 7.31,14.09 J-2.14
PB6
  Top 0.152: U$1.92 24.08,14.09 J-2.23
PB7
  Top 0.152: U$1.93 23.52,12.83 8.56,12.83 J-2.15
PB8
  Top 0.152: U$1.95 23.66,11.55 J-2.22
PB9
  Top 0.152: U$1.96 23.13,10.31 8.61,10.31 7.31,9.01 J-2.16
PB14
  Top 0.152: U$1.53 31.06,36.39 31.06,37.26 32.64,38.84 51.66,38.84 52.27,38.23 58.45,38.23 59.71,39.49 J-3.15
PB15
  Top 0.152: U$1.54 30.58,36.16 30.58,37.59 32.48,39.49 J-3.22
PC1
  Top 0.152: U$1.16 41.14,21.36 49.3,21.36 55.3,15.37 58.55,15.37 59.81,16.63 J-3.6
PC4
  Top 0.152: U$1.33 41.84,31.14 48.11,31.14 55,24.25 J-3.28
PC5
  Top 0.152: U$1.34 41.66,31.67 48.31,31.67 54.46,25.53 58.6,25.53 59.83,26.76 J-3.10
PC6
  Top 0.152: U$1.63 17.05,43.33 8.56,43.33 7.29,42.06 J-2.3
PC7
  Top 0.152: U$1.64 17.64,42.03 J-2.34
PC8
  Top 0.152: U$1.65 18.2,40.77 8.53,40.77 7.29,39.52 J-2.4
PC9
  Top 0.152: U$1.66 18.77,39.49 J-2.33
PC10
  Top 0.152: U$1.78 24.15,24.05 17.4,24.05 10.85,30.61 8.81,30.61 7.54,29.33 J-2.8
PC11
  Top 0.152: U$1.79 24.32,23.52 16.92,23.52 11.11,29.33 J-2.29
PC12
  Top 0.152: U$1.80 24.42,22.91 16.13,22.91 10.95,28.09 8.66,28.09 7.36,26.79 J-2.9
PC13
  Top 0.152: J-3.34 56.6,9.01 47.8,17.8 38.34,17.8 U$1.7
PC14
  Top 0.152: U$1.8 38.61,18.24 48.39,18.24 56.34,10.29 58.62,10.29 59.83,11.49 J-3.4
PC15
  Top 0.152: U$1.9 38.58,18.97 48.59,18.97 56.01,11.55 J-3.33
PD0
  Top 0.152: U$1.81 24.46,22.25 15.7,22.25 11.16,26.79 J-2.28
PD1
  Top 0.152: U$1.82 24.54,21.61 15.09,21.61 11.18,25.53 8.59,25.53 7.31,24.25 J-2.10
PD2
  Top 0.152: U$1.83 24.56,20.93 14.53,20.93 11.21,24.25 J-2.27
PD3
  Top 0.152: U$1.84 24.58,20.24 14.05,20.24 11.28,23.01 8.61,23.01 7.31,21.71 J-2.11
PD4
  Top 0.152: U$1.85 24.65,19.61 13.66,19.61 11.56,21.71 J-2.26
PD5
  Top 0.152: U$1.86 24.65,18.9 12.78,18.9 11.18,20.5 8.61,20.5 J-2.12
PD6
  Top 0.152: U$1.87 24.59,18.14 12.24,18.14 11.21,19.17 J-2.25
PD7
  Top 0.152: U$1.88 24.41,17.25 11.76,17.25 11.05,17.96 8.69,17.96 7.36,16.63 J-2.13
PD8
  Top 0.152: U$1.55 30,36.04 30,37.92 32.84,40.77 58.47,40.77 59.74,42.03 J-3.16
PD9
  Top 0.152: U$1.56 29.31,36.02 29.31,38.23 33.12,42.03 J-3.21
PD10
  Top 0.152: U$1.57 28.57,36.05 28.57,38.48 33.43,43.33 58.5,43.33 59.74,44.57 J-3.17
PD11
  Top 0.152: U$1.58 27.84,36.08 27.84,38.56 33.85,44.57 J-3.20
PD12
  Top 0.152: U$1.59 14.75,48.46 8.59,48.46 7.29,47.17 J-2.1
PD13
  Top 0.152: U$1.60 15.39,47.11 J-2.36
PD14
  Top 0.152: U$1.61 15.93,45.87 8.64,45.87 7.34,44.57 J-2.2
PD15
  Top 0.152: U$1.62 16.52,44.57 J-2.35
PE0
  Top 0.152: U$1.97 22.54,9.01 J-2.21
PE1
  Top 0.152: U$1.98 21.98,7.75 8.59,7.75 7.31,6.47 J-2.17
PE2
  Top 0.152: U$1.1 38.13,13.77 45.49,13.77 56.72,2.54 59.18,2.54 59.83,3.19 J-3.1
PE3
  Top 0.152: U$1.2 38.13,14.48 46.05,14.48 56.6,3.93 J-3.36
PE4
  Top 0.152: U$1.3 38.2,15.11 46.48,15.11 56.39,5.21 58.37,5.21 59.63,6.47 J-3.2
PE5
  Top 0.152: U$1.4 38.17,15.85 47.27,15.85 56.65,6.47 J-3.35
PE6
  Top 0.152: U$1.5 38.06,16.66 47.5,16.66 56.41,7.75 58.32,7.75 59.58,9.01 J-3.3
PE7
  Top 0.152: U$1.38 39.9,32.74 48.64,32.74 54.59,26.79 J-3.27
PE8
  Top 0.152: U$1.39 39.88,33.43 49.05,33.43 54.36,28.12 58.45,28.12 59.66,29.33 J-3.11
PE9
  Top 0.152: U$1.40 39.73,33.98 49.38,33.98 54.03,29.33 J-3.26
PE10
  Top 0.152: U$1.41 39.64,34.59 49.66,34.59 53.62,30.63 58.4,30.63 59.63,31.87 J-3.12
PE11
  Top 0.152: U$1.42 39.62,35.28 49.94,35.28 53.34,31.87 J-3.25
PE12
  Top 0.152: U$1.43 39.62,35.99 50.29,35.99 53.11,33.17 58.5,33.17 59.74,34.41 J-3.13
PE13
  Top 0.152: U$1.44 39.62,36.7 50.49,36.7 52.79,34.41 J-3.24
PE14
  Top 0.152: U$1.45 39.68,37.47 50.83,37.47 52.6,35.69 58.62,35.69 59.83,36.89 J-3.14
PE15
  Top 0.152: U$1.46 39.66,38.15 51.1,38.15 52.3,36.95 J-3.23
SWCLK  (via drill 0.3 pad 0.45)
  Top 0.152: U$1.76 v25.02,26.34
  Bottom 0.152: J1.3 34.11,17.78 25.55,26.34 v25.02,26.34
SWDIO  (via drill 0.3 pad 0.45)
  Top 0.152: v26.09,27.96 26.05,27.96 U$1.72
  Bottom 0.152: J1.2 36.65,15.77 26.95,25.48 26.95,27.1 v26.09,27.96
USB_CLKOUT  (via drill 0.3 pad 0.45)
  Top 0.152: U-1.14 v27.14,43.93 v27.15,43.92 | U$1.30 v41.12,28.3
  Bottom 0.152: v41.12,28.3 37.31,28.3 27.15,38.46 v27.15,43.92
USB_DATA0  (via drill 0.3 pad 0.45)
  Top 0.152: U-1.24 v29.54,49.3 | v44.17,28.5 44.15,28.5 U$1.26
  Bottom 0.152: v29.54,49.3 31.47,49.3 44.53,36.25 44.53,28.85 v44.17,28.5
USB_DATA1  (via drill 0.3 pad 0.45)
  Top 0.152: U-1.23 v29.99,48.8 v30,48.79 | v41.33,32.05 v41.33,32.04 U$1.35
  Bottom 0.152: v30,48.79 31.14,48.79 41.5,38.43 41.5,32.23 v41.33,32.05
USB_DATA2  (via drill 0.3 pad 0.45)
  Top 0.152: U-1.22 29.4,48.3 v29.41,48.31 | v40.66,32.08 40.66,32.08 U$1.36
  Bottom 0.152: v29.41,48.31 30.89,48.31 40.92,38.28 40.92,32.33 v40.66,32.08
USB_DATA3  (via drill 0.3 pad 0.45)
  Top 0.152: U-1.21 v29.94,47.8 v29.95,47.8 | v37.06,36.27 v37.06,36.26 U$1.47
  Bottom 0.152: v29.95,47.8 30.71,47.8 37.29,41.22 37.29,36.5 v37.06,36.27
USB_DATA4  (via drill 0.3 pad 0.45)
  Top 0.152: U-1.20 v29.43,47.3 v29.44,47.3 | U$1.48 v36.41,36.32 v36.42,36.32
  Bottom 0.152: v36.42,36.32 36.42,41.3 30.43,47.3 v29.44,47.3
USB_DATA5  (via drill 0.3 pad 0.45)
  Top 0.152: U-1.19 29.91,46.8 v29.92,46.81 | v33.02,36.6 U$1.51
  Bottom 0.152: v29.92,46.81 33.02,43.71 v33.02,36.6
USB_DATA6  (via drill 0.3 pad 0.45)
  Top 0.152: U-1.18 v29.38,46.3 v29.39,46.3 | U$1.52 31.57,36.59 v31.57,36.6
  Bottom 0.152: v31.57,36.6 31.57,44.12 v29.39,46.3
USB_DATA7  (via drill 0.3 pad 0.45)
  Top 0.152: U-1.17 29.08,45.8 v29.29,45.59 | v33.88,32.84 33.88,24.6 U$1.91
  Bottom 0.152: v29.29,45.59 30.68,44.2 30.68,36.04 v33.88,32.84
USB_DIR  (via drill 0.3 pad 0.45)
  Top 0.152: U$1.17 v35.23,27.98 v35.23,27.99 | v26.14,43.79 U-1.12
  Bottom 0.152: v35.23,27.99 26.14,37.08 v26.14,43.79
USB_NXT  (via drill 0.3 pad 0.45)
  Top 0.152: U$1.18 35.2,28.71 v35.2,28.73 | v26.64,37.24 25.64,38.24 U-1.11
  Bottom 0.152: v35.2,28.73 26.7,37.24 v26.64,37.24
USB_STP  (via drill 0.3 pad 0.45)
  Top 0.152: U$1.15 34.72,27.07 v34.72,29.87 | v26.64,44.42 v26.64,44.43 U-1.13
  Bottom 0.152: v34.72,29.87 26.64,37.95 v26.64,44.42
VIN5V
  Top 0.152: P-1.3 47.78,53.12 48.28,53.62 49.68,53.62 49.69,53.61
  Top 0.508: J-3.18 53.33,53.61 C26.1 49.69,53.61 P-1.1

### Text on the board
tPlace: USB-HS | GND | VIN5V | PD12 | PD13 | PD11 | PD10 | PD14 | PD15 | PD8 | PC6 | PC7 | PD9 | PB15 | PB14 | PC8 | PC9 | PE14 | PA9 | PE15 | PA8 | PE13 | PE12 | PA10 | PA11 | PA15 | PE11 | PE10 | PA12 | PE9 | PE8 | PC10 | PC11 | PE7 | PC5 | PC12 | PD0 | PC4 | PA7 | PD1 | PD2 | PA6 | PA4 | PD3 | PD4 | PA2 | PA1 | PD5 | PD6 | PA0 | PC1 | PD7 | PB3 | GND | NRST | PB4 | PB6 | PC15 | PC14 | PB7 | PB8 | GND | SWCLK | SWDIO | +3V3 | PC13 | PB9 | PE0 | PE6 | PE5 | PE4 | PE1 | GND | PE3 | PE2 | +3V3 | +3V3